# Altium schematic sheet Sunday.SchDoc
size A4
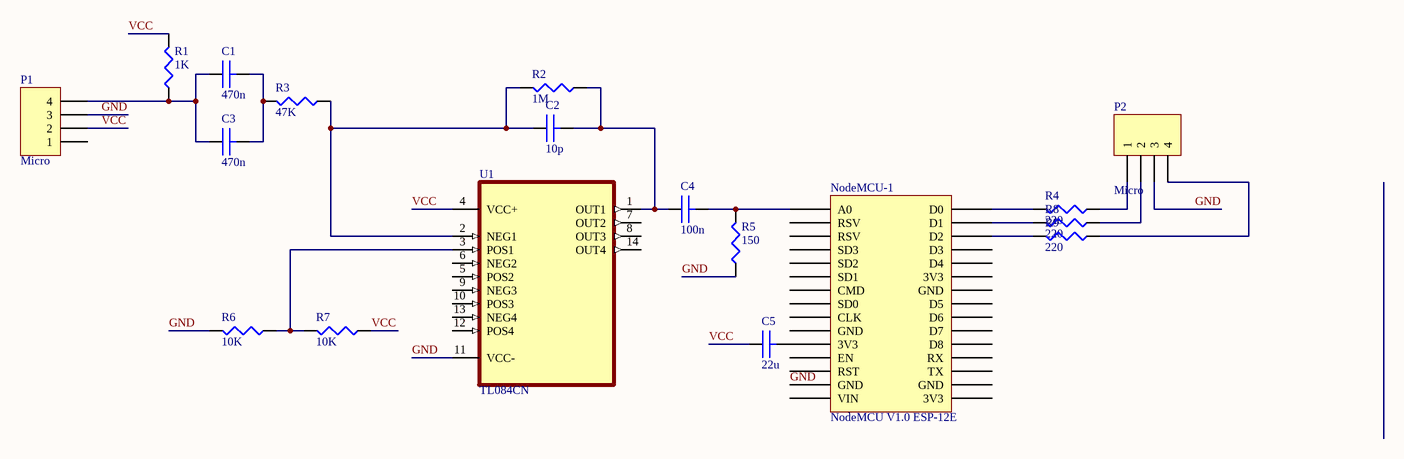
[diagram p0: Sunday.SchDoc]

## Parts
C1  value 470n  [RAD0.2]  (hidden comment: CAP)
C2  value 10p  [RAD0.2]  (hidden comment: CAP)
C3  value 470n  [RAD0.2]  (hidden comment: CAP)
C4  value 100n  [RAD0.2]  (hidden comment: CAP)
C5  value 22u  [RAD0.2]  (hidden comment: CAP)
NodeMCU-1  NodeMCU V1.0 ESP-12E  [NodeMCU V1.0 ESP-12E]
P1  Micro  [HDR1X4]
P2  Micro  [HDR1X4]
R1  value 1K  [AXIAL0.4]  (hidden comment: RES)
R2  value 1M  [AXIAL0.4]  (hidden comment: RES)
R3  value 47K  [AXIAL0.4]  (hidden comment: RES)
R4  value 220  [AXIAL0.4]  (hidden comment: RES)
R5  value 150  [AXIAL0.4]  (hidden comment: RES)
R6  value 10K  [AXIAL0.4]  (hidden comment: RES)
R7  value 10K  [AXIAL0.4]  (hidden comment: RES)
R8  value 220  [AXIAL0.4]  (hidden comment: RES)
R9  value 220  [AXIAL0.4]  (hidden comment: RES)
U1  TL084CN  [DIP254P762X510-14]

## Nets
GND: NodeMCU-1.GND P1.3 P2.3 R5.1 R6.2 U1.11(VCC-)
VCC: C5.1 P1.2 R1.2 R7.1 U1.4(VCC+)
NetC1_1: C1.1 C3.1 P1.4 R1.1
NetC1_2: C1.2 C3.2 R3.2
NetC2_1: C2.1 R2.2 R3.1 U1.2(NEG1)
NetC2_2: C2.2 C4.1 R2.1 U1.1(OUT1)
NetC4_2: C4.2 NodeMCU-1.A0 R5.2
NetC5_2: C5.2 NodeMCU-1.3V3
NetNodeMCU-1_D0: NodeMCU-1.D0 R4.2
NetNodeMCU-1_D1: NodeMCU-1.D1 R8.2
NetNodeMCU-1_D2: NodeMCU-1.D2 R9.2
NetP2_1: P2.1 R4.1
NetP2_2: P2.2 R8.1
NetP2_4: P2.4 R9.1
NetR6_1: R6.1 R7.2 U1.3(POS1)

Not connected (* = marked no-connect by the designer): NodeMCU-1 CLK CMD D3 D4 D5 D6 D7 D8 EN RST RSV RX SD0 SD1 SD2 SD3 TX VIN; P1 1; U1 5(POS2) 6(NEG2) 7(OUT2) 8(OUT3) 9(NEG3) 10(POS3) 12(POS4) 13(NEG4) 14(OUT4)

## Library data of the parts
C1-C5 = CAP: capacité non polarisée
NodeMCU-1 = NodeMCU V1.0 ESP-12E: NodeMCU V1.0 ESP8266 (ESP-12E)
P1 P2 = Header 4: Header, 4-Pin; LatestRevisionDate: 17-Jul-2002; LatestRevisionNote: Re-released for DXP Platform.; Publisher: Altium Limited
R1-R9 = RES: resistance
U1 = TL084CN: J-FET Amplifier 4 Circuit 14-DIP; MF: STMicroelectronics; Value: *; Price: None; Package: DIP-14 STMicroelectronics; SnapEDA_Link: https://www.snapeda.com/parts/TL084CN/STMicroelectronics/view-part/1137005/?ref=snap; Availability: Unavailable; MP: TL084CN